# EAGLE schematic Midi_LED_Rings_Black_10x5_gerbers_v4 (EAGLE 6.5.0)
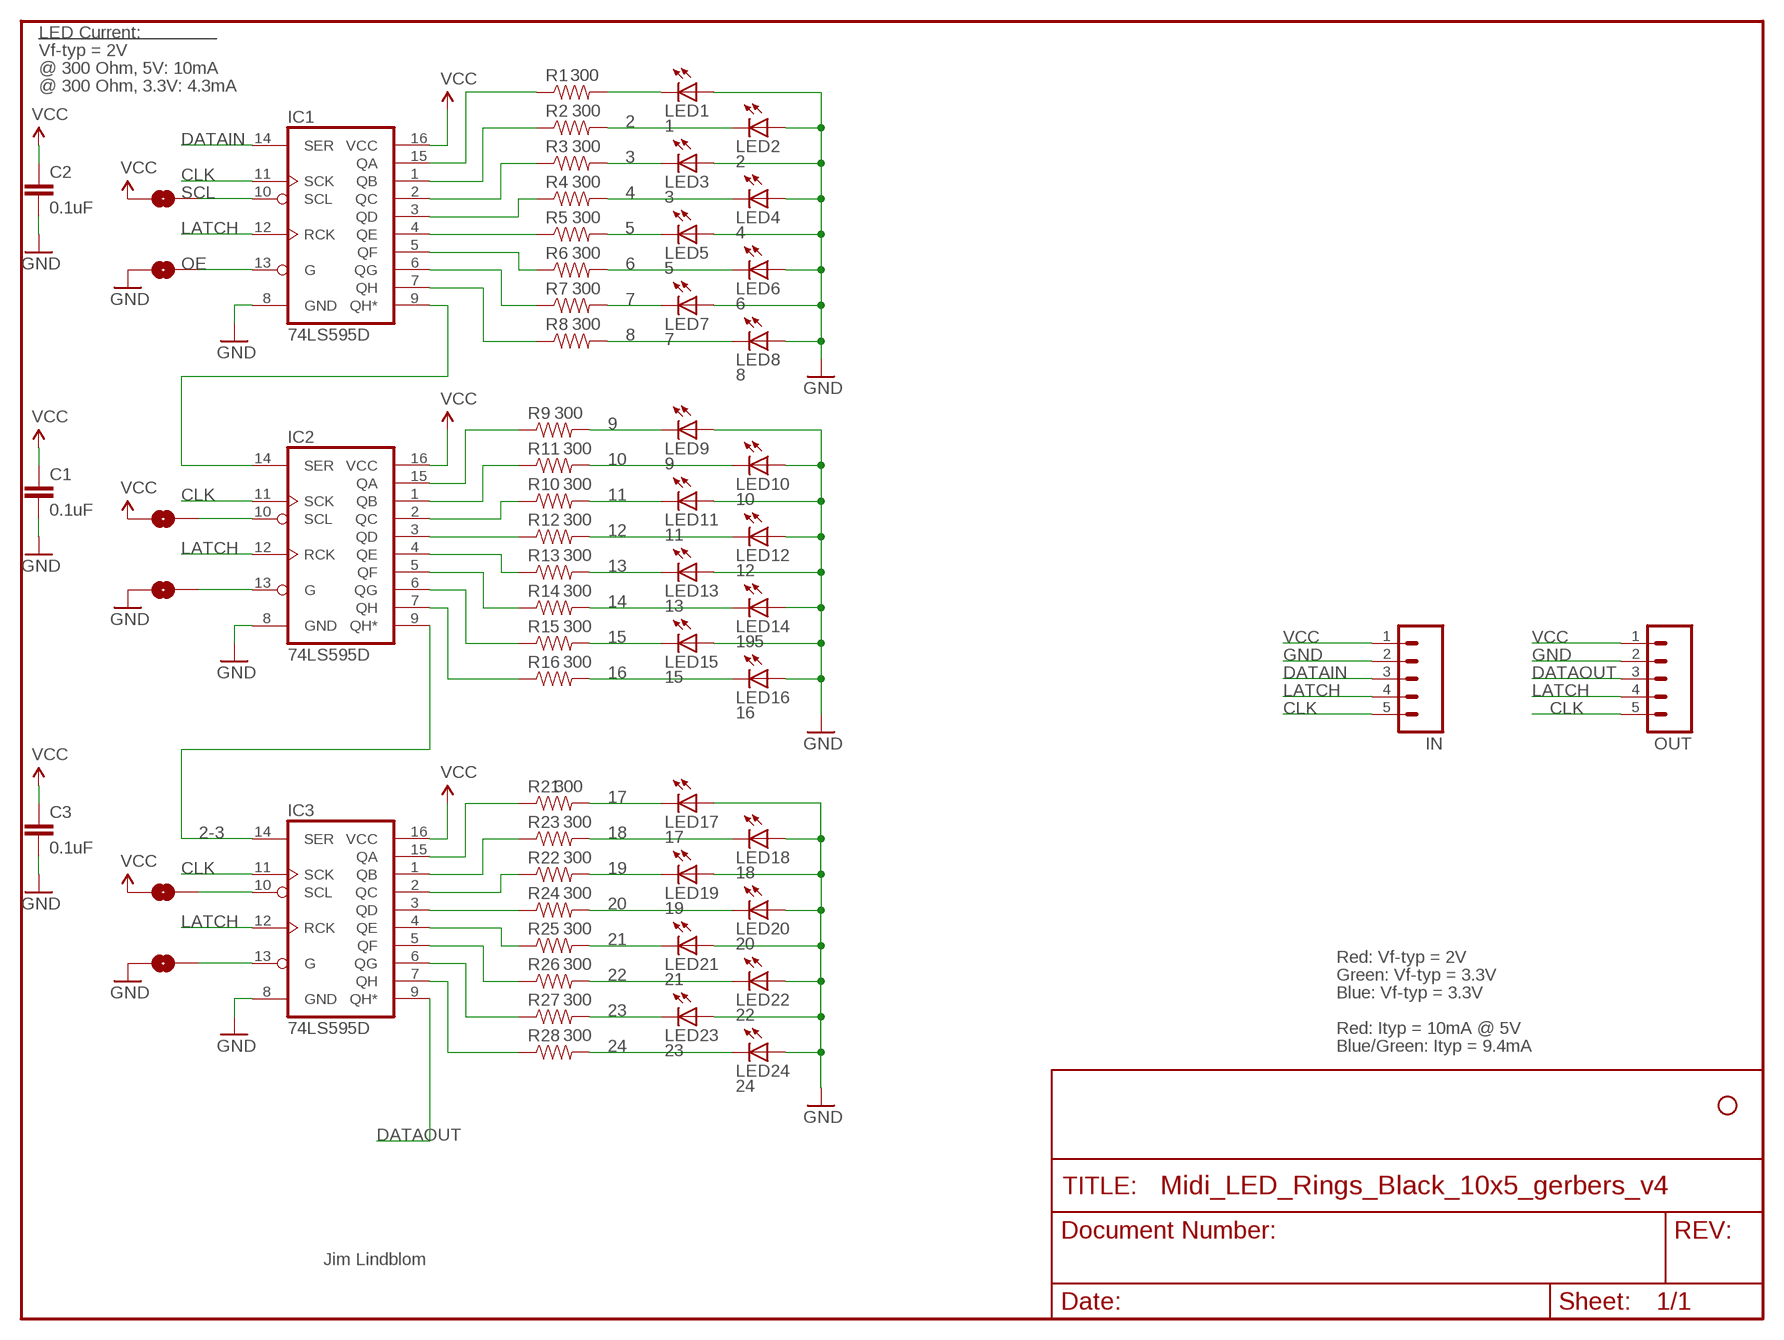
[diagram p0: schematic, sheet 1]

## Parts
C1  0.1uF  CAP0402-CAP  [0402-CAP]
C2  0.1uF  CAP0402-CAP  [0402-CAP]
C3  0.1uF  CAP0402-CAP  [0402-CAP]
IC1  74LS595D  [SO16]
IC2  74LS595D  [SO16]
IC3  74LS595D  [SO16]
IN  M05LOCK  [1X05_LOCK]
JP12  STAND-OFF  [STAND-OFF]
LED1  1  LED1206  [LED-1206]
LED2  2  LED1206  [LED-1206]
LED3  3  LED1206  [LED-1206]
LED4  4  LED1206  [LED-1206]
LED5  5  LED1206  [LED-1206]
LED6  6  LED1206  [LED-1206]
LED7  7  LED1206  [LED-1206]
LED8  8  LED1206  [LED-1206]
LED9  9  LED1206  [LED-1206]
LED10  10  LED1206  [LED-1206]
LED11  11  LED1206  [LED-1206]
LED12  12  LED1206  [LED-1206]
LED13  13  LED1206  [LED-1206]
LED14  195  LED1206  [LED-1206]
LED15  15  LED1206  [LED-1206]
LED16  16  LED1206  [LED-1206]
LED17  17  LED1206  [LED-1206]
LED18  18  LED1206  [LED-1206]
LED19  19  LED1206  [LED-1206]
LED20  20  LED1206  [LED-1206]
LED21  21  LED1206  [LED-1206]
LED22  22  LED1206  [LED-1206]
LED23  23  LED1206  [LED-1206]
LED24  24  LED1206  [LED-1206]
OUT  M05LOCK  [1X05_LOCK]
R1  300  RESISTOR0805-RES  [0805]
R2  300  RESISTOR0805-RES  [0805]
R3  300  RESISTOR0805-RES  [0805]
R4  300  RESISTOR0805-RES  [0805]
R5  300  RESISTOR0805-RES  [0805]
R6  300  RESISTOR0805-RES  [0805]
R7  300  RESISTOR0805-RES  [0805]
R8  300  RESISTOR0805-RES  [0805]
R9  300  RESISTOR0805-RES  [0805]
R10  300  RESISTOR0805-RES  [0805]
R11  300  RESISTOR0805-RES  [0805]
R12  300  RESISTOR0805-RES  [0805]
R13  300  RESISTOR0805-RES  [0805]
R14  300  RESISTOR0805-RES  [0805]
R15  300  RESISTOR0805-RES  [0805]
R16  300  RESISTOR0805-RES  [0805]
R21  300  RESISTOR0805-RES  [0805]
R22  300  RESISTOR0805-RES  [0805]
R23  300  RESISTOR0805-RES  [0805]
R24  300  RESISTOR0805-RES  [0805]
R25  300  RESISTOR0805-RES  [0805]
R26  300  RESISTOR0805-RES  [0805]
R27  300  RESISTOR0805-RES  [0805]
R28  300  RESISTOR0805-RES  [0805]
SJ1  SOLDERJUMPERTRACE  [SJ_2S-TRACE]
SJ2  SOLDERJUMPERTRACE  [SJ_2S-TRACE]
SJ3  SOLDERJUMPERTRACE  [SJ_2S-TRACE]
SJ4  SOLDERJUMPERTRACE  [SJ_2S-TRACE]
SJ5  SOLDERJUMPERTRACE  [SJ_2S-TRACE]
SJ6  SOLDERJUMPERTRACE  [SJ_2S-TRACE]

## Nets
1-2: IC1.9(QH*) IC2.14(SER)
2: LED2.C R2.2
2-3: IC2.9(QH*) IC3.14(SER)
3: LED3.C R3.2
4: LED4.C R4.2
5: LED5.C R5.2
6: LED6.C R6.2
7: LED7.C R7.2
8: LED8.C R8.2
9: LED9.C R9.2
10: LED10.C R11.2
11: LED11.C R10.2
12: LED12.C R12.2
13: LED13.C R13.2
14: LED14.C R14.2
15: LED15.C R15.2
16: LED16.C R16.2
17: LED17.C R21.2
18: LED18.C R23.2
19: LED19.C R22.2
20: LED20.C R24.2
21: LED21.C R25.2
22: LED22.C R26.2
23: LED23.C R27.2
24: LED24.C R28.2
CLK: IC1.11(SCK) IC2.11(SCK) IC3.11(SCK) IN.5 OUT.5
DATAIN: IC1.14(SER) IN.3
DATAOUT: IC3.9(QH*) OUT.3
GND: C1.2 C2.2 C3.2 IC1.8(GND) IC2.8(GND) IC3.8(GND) IN.2 LED1.A LED2.A LED3.A LED4.A LED5.A LED6.A LED7.A LED8.A LED9.A LED10.A LED11.A LED12.A LED13.A LED14.A LED15.A LED16.A LED17.A LED18.A LED19.A LED20.A LED21.A LED22.A LED23.A LED24.A OUT.2 SJ2.1 SJ4.1 SJ6.1
LATCH: IC1.12(RCK) IC2.12(RCK) IC3.12(RCK) IN.4 OUT.4
N$1: IC1.15(QA) R1.1
N$2: IC1.1(QB) R2.1
N$3: IC1.2(QC) R3.1
N$4: IC1.3(QD) R4.1
N$5: IC1.4(QE) R5.1
N$6: IC1.5(QF) R6.1
N$7: IC1.6(QG) R7.1
N$8: IC1.7(QH) R8.1
N$9: IC2.15(QA) R9.1
N$10: IC2.1(QB) R11.1
N$11: IC2.2(QC) R10.1
N$12: IC2.3(QD) R12.1
N$13: IC2.4(QE) R13.1
N$14: IC2.5(QF) R14.1
N$15: IC2.6(QG) R15.1
N$16: IC2.7(QH) R16.1
N$17: IC3.15(QA) R21.1
N$18: IC3.1(QB) R23.1
N$19: IC3.2(QC) R22.1
N$20: IC3.3(QD) R24.1
N$21: IC3.4(QE) R25.1
N$22: IC3.5(QF) R26.1
N$23: IC3.6(QG) R27.1
N$24: IC3.7(QH) R28.1
N$25: IC2.13(G) SJ4.2
N$26: IC2.10(SCL) SJ3.2
N$27: IC3.10(SCL) SJ5.2
N$28: IC3.13(G) SJ6.2
N$30: LED1.C R1.2
OE: IC1.13(G) SJ2.2
SCL: IC1.10(SCL) SJ1.2
VCC: C1.1 C2.1 C3.1 IC1.16(VCC) IC2.16(VCC) IC3.16(VCC) IN.1 OUT.1 SJ1.1 SJ3.1 SJ5.1

## Notes on the sheet
- LED Current:
- Vf-typ = 2V
- @ 300 Ohm, 5V: 10mA
- @ 300 Ohm, 3.3V: 4.3mA
- Red: Vf-typ = 2V
- Green: Vf-typ = 3.3V
- Blue: Vf-typ = 3.3V
- Red: Ityp = 10mA @ 5V
- Blue/Green: Ityp = 9.4mA
- Jim Lindblom

## Library data of the parts
C1-C3 = SparkFun:CAP: Capacitor Standard 0603 ceramic capacitor, and 0.1" leaded capacitor.
IC1-IC3 = SparkFun:74*595: 8-bit SHIFT REGISTER, output latch
IN OUT = SparkFun-Connectors:M05: Header 5 Standard 5-pin 0.1" header. Use with straight break away headers (SKU : PRT-00116), right angle break away headers (PRT-00553), swiss pins (PRT-00743), machine pins (PRT-00117), and female headers (PRT-00115). Molex polarized connector foot print use with SKU : PRT-08230 with associated crimp pins and housings.
JP12 = SparkFun:STAND-OFF: Stand Off This is the mechanical footprint for a #4 phillips button head screw. Use the keepout ring to avoid running the screw head into surrounding components. SKU : PRT-00447
LED1-LED24 = SparkFun-LED:LED: LEDs Standard schematic elements and footprints for 5mm, 3mm, 1206, and 0603 sized LEDs. 5mm - Spark Fun Electronics SKU : COM-00529 (and others)
R1-R16 R21-R28 = SparkFun:RESISTOR: Resistor Basic schematic elements and footprints for 0603, 1206, and PTH resistors.
SJ1-SJ6 = SparkFun-Passives:SOLDERJUMPER: Solder Jumper Standard SMD solder jumper. Used to automate production. Two varients : Normally Open and Normally Closed are the same, but have different paste layers. NC will have a large amount of paste and should jumper during reflow.